# Altium schematic sheet [10] - SATA, CSI.SchDoc
size A3; DocumentNumber: 10; SheetNumber: 10; SheetTotal: 18
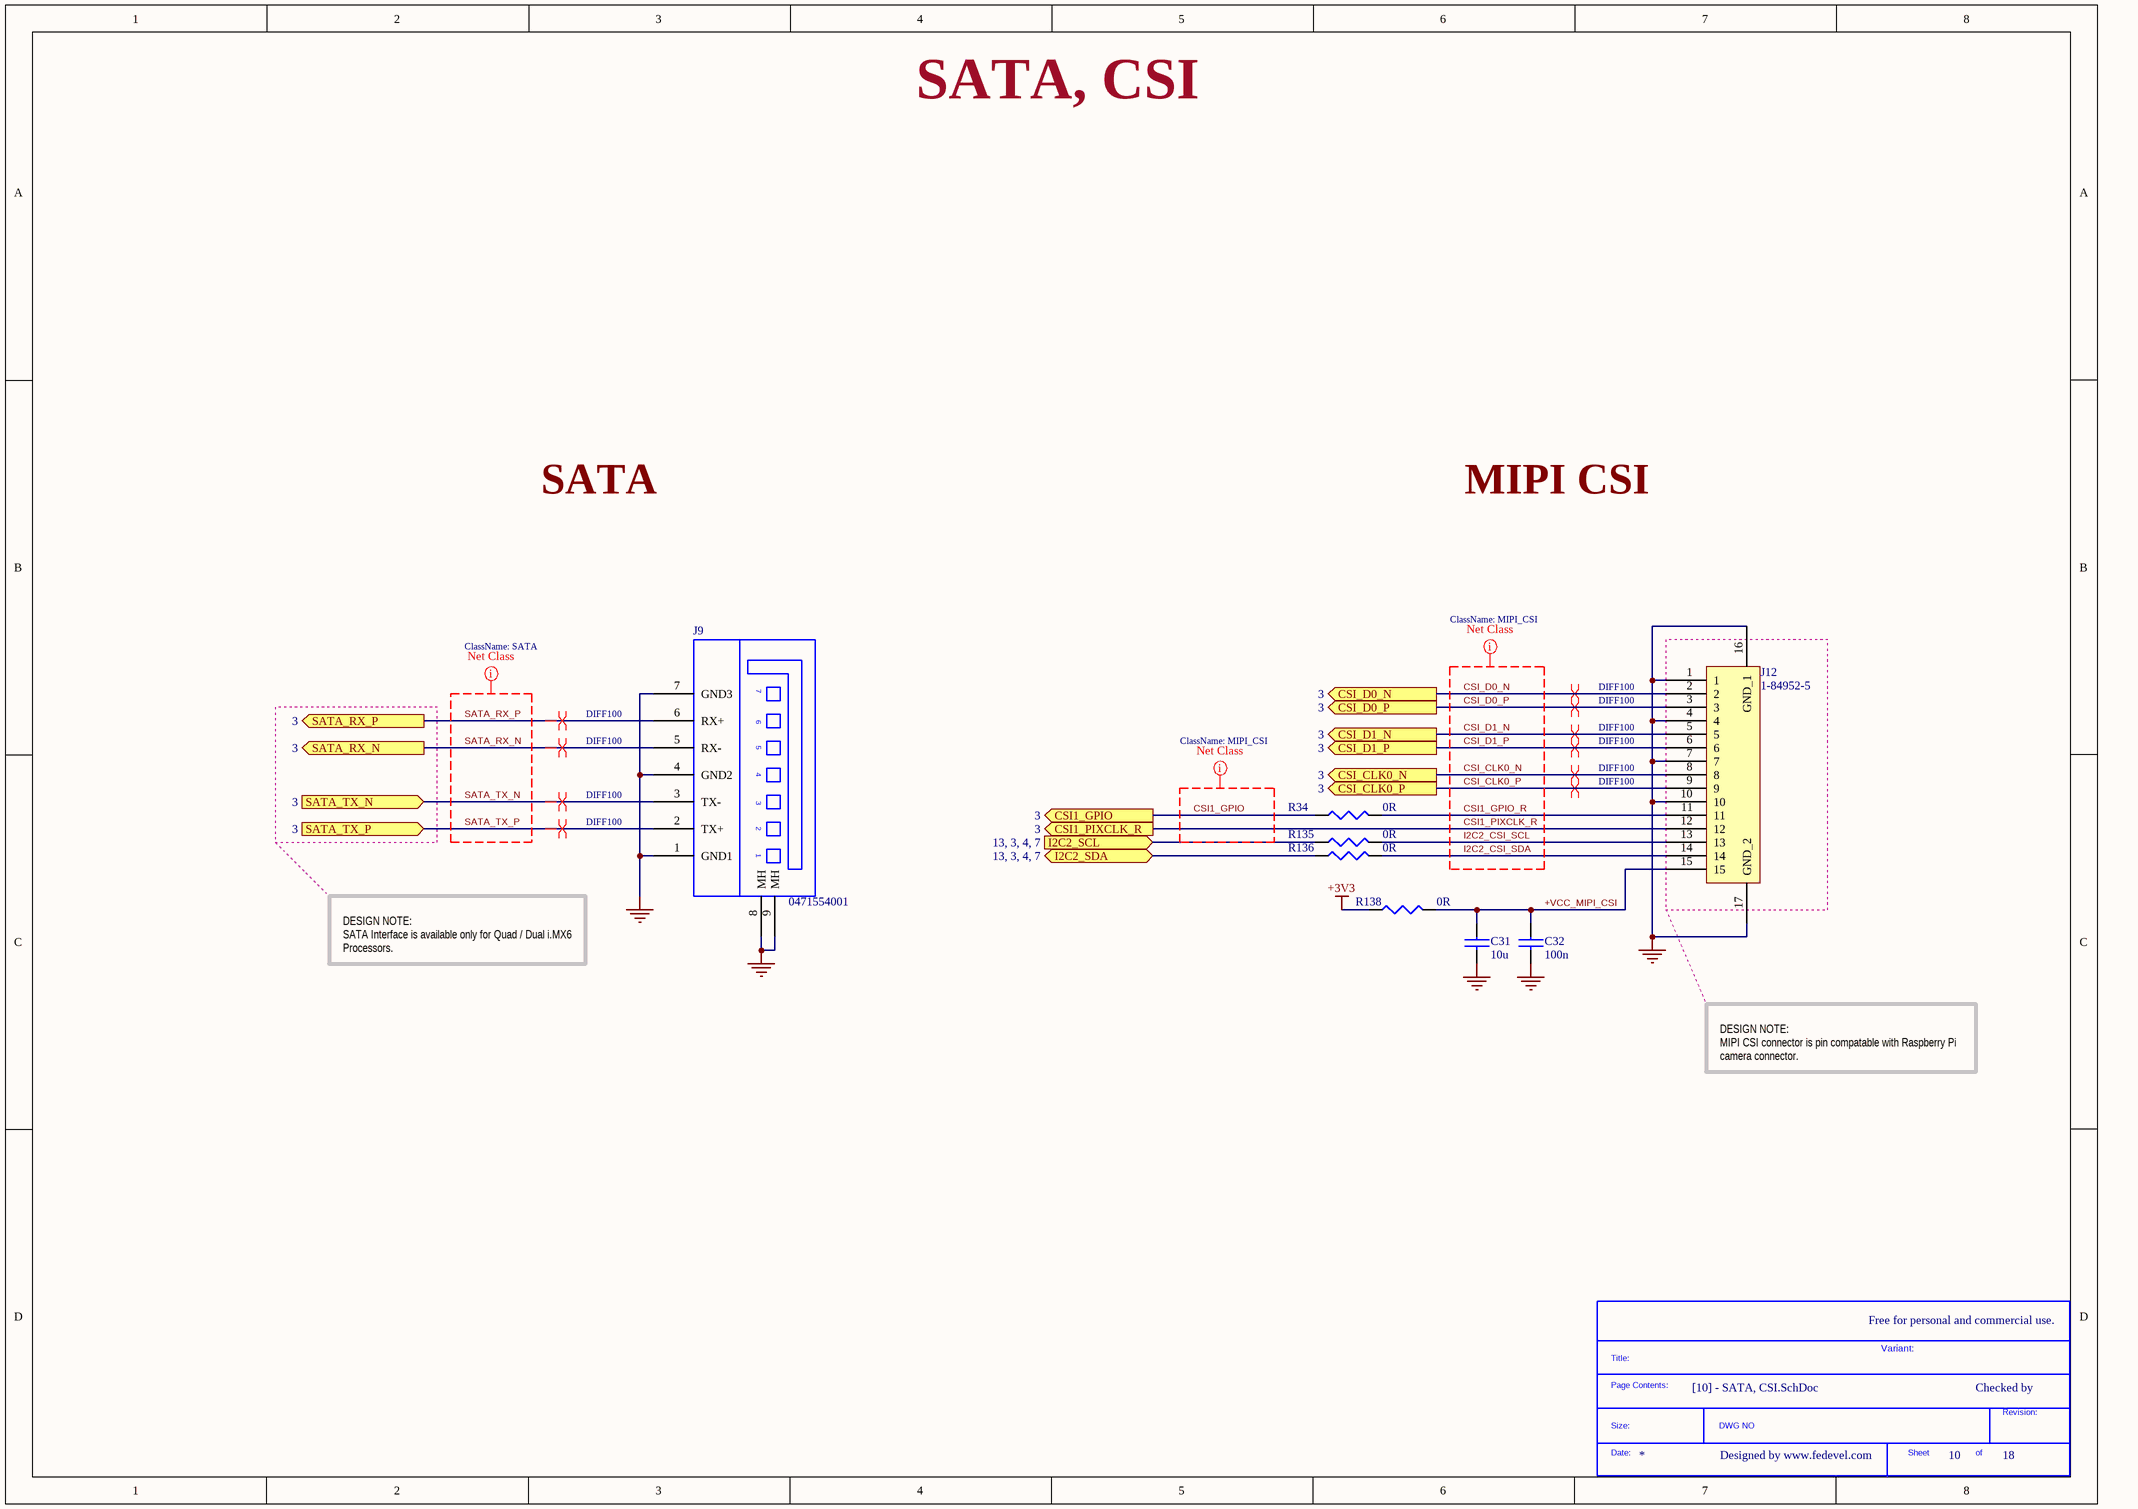
[diagram p0: [10] - SATA, CSI.SchDoc]

## Parts
*  SDTitleBlock  (value not drawn)  (graphical)
C31  10u  [C0603]
C32  100n  [C0402]
J9  0471554001  [SATA_VERTICAL]
J12  1-84952-5  [ZIF_RA_BOTTOM_15x1mm]
R34  0R  [R0402]
R135  0R  [R0402]
R136  0R  [R0402]
R138  0R  [R0402]

## Ports
CSI1_GPIO (out, see 3), CSI1_PIXCLK_R (out, see 3), CSI_CLK0_N (out, see 3), CSI_CLK0_P (out, see 3), CSI_D0_N (out, see 3), CSI_D0_P (out, see 3), CSI_D1_N (out, see 3), CSI_D1_P (out, see 3), I2C2_SCL (see 13, 3, 4, 7), I2C2_SDA (bidir, see 13, 3, 4, 7), SATA_RX_N (out, see 3), SATA_RX_P (out, see 3), SATA_TX_N (in, see 3), SATA_TX_P (in, see 3)

## Nets
+3V3: R138.1
GND: C31.2 C32.2 J9.1(GND1) J9.4(GND2) J9.7(GND3) J9.8(MH) J9.9(MH) J12.1 J12.4 J12.7 J12.10 J12.16(GND_1) J12.17(GND_2)
+VCC_MIPI_CSI: C31.1 C32.1 J12.15 R138.2
CSI1_GPIO: R34.2 ; port CSI1_GPIO
CSI1_GPIO_R: J12.11 R34.1
CSI1_PIXCLK_R: J12.12 ; port CSI1_PIXCLK_R
CSI_CLK0_N: J12.8 ; port CSI_CLK0_N
CSI_CLK0_P: J12.9 ; port CSI_CLK0_P
CSI_D0_N: J12.2 ; port CSI_D0_N
CSI_D0_P: J12.3 ; port CSI_D0_P
CSI_D1_N: J12.5 ; port CSI_D1_N
CSI_D1_P: J12.6 ; port CSI_D1_P
I2C2_CSI_SCL: J12.13 R135.1
I2C2_CSI_SDA: J12.14 R136.1
I2C2_SCL: R135.2 ; port I2C2_SCL
I2C2_SDA: R136.2 ; port I2C2_SDA
SATA_RX_N: J9.5(RX-) ; port SATA_RX_N
SATA_RX_P: J9.6(RX+) ; port SATA_RX_P
SATA_TX_N: J9.3(TX-) ; port SATA_TX_N
SATA_TX_P: J9.2(TX+) ; port SATA_TX_P

## Layout directives
differential pair; net class DIFF100: CSI_CLK0_N, CSI_CLK0_P, CSI_D0_N, CSI_D0_P, CSI_D1_N, CSI_D1_P, SATA_RX_N, SATA_RX_P, SATA_TX_N, SATA_TX_P
net class SATA: SATA_RX_N, SATA_RX_P, SATA_TX_N, SATA_TX_P
net class MIPI_CSI: CSI1_GPIO, CSI1_GPIO_R, CSI1_PIXCLK_R, CSI_CLK0_N, CSI_CLK0_P, CSI_D0_N, CSI_D0_P, CSI_D1_N, CSI_D1_P, I2C2_CSI_SCL, I2C2_CSI_SDA

## Notes on the sheet
- SATA, CSI
- SATA
- MIPI CSI
- DESIGN NOTE:
  SATA Interface is available only for Quad / Dual i.MX6 Processors.
- DESIGN NOTE:
  MIPI CSI connector is pin compatable with Raspberry Pi camera connector.
- Free for personal and commercial use.
- Variant:
- Checked by
- Designed by www.fedevel.com
- (in symbol SDTitleBlock) Title:; Page Contents:; Revision:; Size:; DWG NO; Date:; Sheet; of

## Library data of the parts
C31 = C1608X5R0J106M: CAP CER 10UF 6.3V X5R 20% 0603; Manufacturer: TDK Corporation; Capacitance: 10µF; Value: 10µF; .Checked PCB: used; Category: Capacitors; Supplier Part Number: 445-4112-1-ND; Manufacturer Part Number: C1608X5R0J106M; Operating Temperature: -55°C ~ 85°C; Package / Case: 0603 (1608 Metric); Price 1k [$]: 0.08580; .Checked SCH: used; Voltage - Rated: 6.3V; Features: Low ESR; Supplier: Digikey; Supplier 1: Digi-Key; Supplier Part Number 1: 445-4112-1-ND; RoHS: RoHS Compliant; Stock 1: 48157; Pricing 1: 1=0.46, 10=0.363, 100=0.1898, 250=0.14024, 500=0.1089, 1000=0.0858 (USD); Tolerance: ±20%; Temperature Coefficient: X5R; Mounting Type: Surface Mount, MLCC; Applications: General Purpose; Ratings: -; Size / Dimension: 0.063" L x 0.031" W (1.60mm x 0.80mm); Height - Seated (Max): -; Thickness (Max): 0.037" (0.95mm); Lead Spacing: -; Packaging: Cut Tape (CT); Lead Style: -; ComponentLink1URL: http://www.tdk.com/pdf/general_B11.pdf; ComponentLink1Description: http://www.tdk.com/pdf/general_B11.pdf
C32 = C1005X5R1H104K: CAP CER .10UF 50V X5R 10% 0402; Manufacturer: TDK Corporation; Capacitance: 0.1µF; Value: 100nF; .Checked PCB: used; Category: Capacitors; Supplier Part Number: 445-5942-1-ND; Manufacturer Part Number: C1005X5R1H104K; Operating Temperature: -55°C ~ 85°C; Package / Case: 0402 (1005 Metric); Price 1k [$]: 0.02340; .Checked SCH: used; Voltage - Rated: 50V; Supplier: Digikey; Supplier 1: Digi-Key; Supplier Part Number 1: 445-5942-1-ND; RoHS: RoHS Compliant; Stock 1: 106926; Pricing 1: 1=0.27, 10=0.18, 100=0.072, 250=0.05176, 500=0.0369, 1000=0.027 (USD); Tolerance: ±10%; Temperature Coefficient: X5R; Mounting Type: Surface Mount, MLCC; Applications: General Purpose; Ratings: -; Size / Dimension: 0.039" L x 0.020" W (1.00mm x 0.50mm); Height - Seated (Max): -; Thickness (Max): 0.022" (0.55mm); Lead Spacing: -; Features: -; Packaging: Cut Tape (CT); Lead Style: -; ComponentLink1URL: http://www.tdk.co.jp/tefe02/e412_c.pdf; ComponentLink1Description: http://www.tdk.co.jp/tefe02/e412_c.pdf
J9 = 0471554001: CONN SATA HDR 7POS PCB VERT; Manufacturer: Molex Inc; Connector Style: Header, Shrouded; Number of Positions: 7; .Checked PCB: used; Supplier 1: Digi-Key; Supplier Part Number 1: WM4059-ND; Manufacturer Part Number: 0471554001; RoHS: RoHS Compliant; Category: Connectors, Interconnects; Stock 1: 8065; Pricing 1: 1=1.37, 10=1.065, 25=0.9928, 50=0.9026, 100=0.8123, 250=0.68592, 500=0.6498, 1000=0.5776, 2500=0.48013 (USD); Connector Type: SATA; Mounting Type: Through Hole; Termination: Solder; Features: Board Lock; Contact Finish: Gold; Contact Finish Thickness: Flash; Packaging: Tray; ComponentLink1URL: http://www.molex.com/elqNow/elqRedir.htm?ref=http://www.molex.com/pdm_docs/sd/471554001_sd.pdf; ComponentLink1Description: http://www.molex.com/elqNow/elqRedir.htm?ref=http://www.molex.com/pdm_docs/sd/471554001_sd.pdf; .Checked SCH: used
J12 = 1-84952-5: CONN FPC BOTTOM 15POS 1.00MM R/A; Manufacturer: TE Connectivity; Connector/Contact Type: Contacts, Bottom; Number of Positions: 15; Pitch: 0.039" (1.00mm); FFC, FCB Thickness: 0.30mm; Locking Feature: Slide Lock; Cable End Type: Straight; Actuator Material: Polyamide (PA), Nylon, Glass Filled; Voltage Rating: 200V; Material Flammability Rating: UL94 V-0; Current Rating: 1A; .Creator: MM; Supplier 1: Digi-Key; Manufacturer Part Number: 1-84952-5; RoHS: RoHS Compliant; Category: Connectors, Interconnects; Stock 1: 3321; Pricing 1: 1=2.32, 10=2.107, 25=1.9776, 50=1.8918, 100=1.8057, 250=1.63376, 500=1.50478 (USD); Packaging: Cut Tape (CT); Flat Flex Type: FPC; Mounting Type: Surface Mount, Right Angle; Termination: Solder; Height Above Board: 0.101" (2.56mm); Contact Material: Phosphor Bronze; Contact Finish: Tin; Housing Material: Liquid Crystal Polymer (LCP), Glass Filled; Features: Solder Retention, Zero Insertion Force (ZIF); Operating Temperature: -40°C ~ 85°C; ComponentLink1URL: http://www.te.com/commerce/DocumentDelivery/DDEController?Action=srchrtrv&DocNm=84952&DocType=Customer+Drawing&DocLang=English; ComponentLink1Description: http://www.te.com/commerce/DocumentDelivery/DDEController?Action=srchrtrv&DocNm=84952&DocType=Customer+Drawing&DocLang=English; Supplier Part Number 1: A101391CT-ND; .Checked PCB: MM; .Checked SCH: MM
R34 R135 R136 R138 = RC0402JR-070RL: RES 0.0 OHM 1/16W 0402 SMD; Manufacturer: Yageo; Resistance (Ohms): 0.0; Power (Watts): 0.063W, 1/16W; Tolerance: Jumper; .Checked PCB: used; Category: Resistors; Supplier Part Number: 311-0.0JRCT-ND; Manufacturer Part Number: RC0402JR-070RL; Package / Case: 0402 (1005 Metric); Price 1k [$]: 0.01389; Value: 0R; .Checked SCH: used; Supplier: Digikey; Supplier 1: Digi-Key; Supplier Part Number 1: 311-0.0JRCT-ND; RoHS: RoHS Compliant; Stock 1: 1106330; Pricing 1: 10=0.012, 50=0.009, 100=0.0069, 250=0.00512, 500=0.0038, 1000=0.00253 (USD); Composition: Thick Film; Features: -; Temperature Coefficient: -; Size / Dimension: 0.039" L x 0.020" W (1.00mm x 0.50mm); Height: 0.016" (0.40mm); Number of Terminations: 2; Packaging: Cut Tape (CT); ComponentLink1URL: http://www.yageo.com/documents/recent/PYu-RC0402_51_RoHS_L_6.pdf; ComponentLink1Description: http://www.yageo.com/documents/recent/PYu-RC0402_51_RoHS_L_6.pdf